# Altium schematic sheet 11_USB_FIFO.SchDoc: USB FIFO
size A4; Organization: Lime Microsystems; Address1: Surrey Tech Centre; Address2: Guildford GU2 7YG; Address3: Surrey; Address4: United Kingdom; Revision: v2.1; SheetNumber: 11; SheetTotal: 15
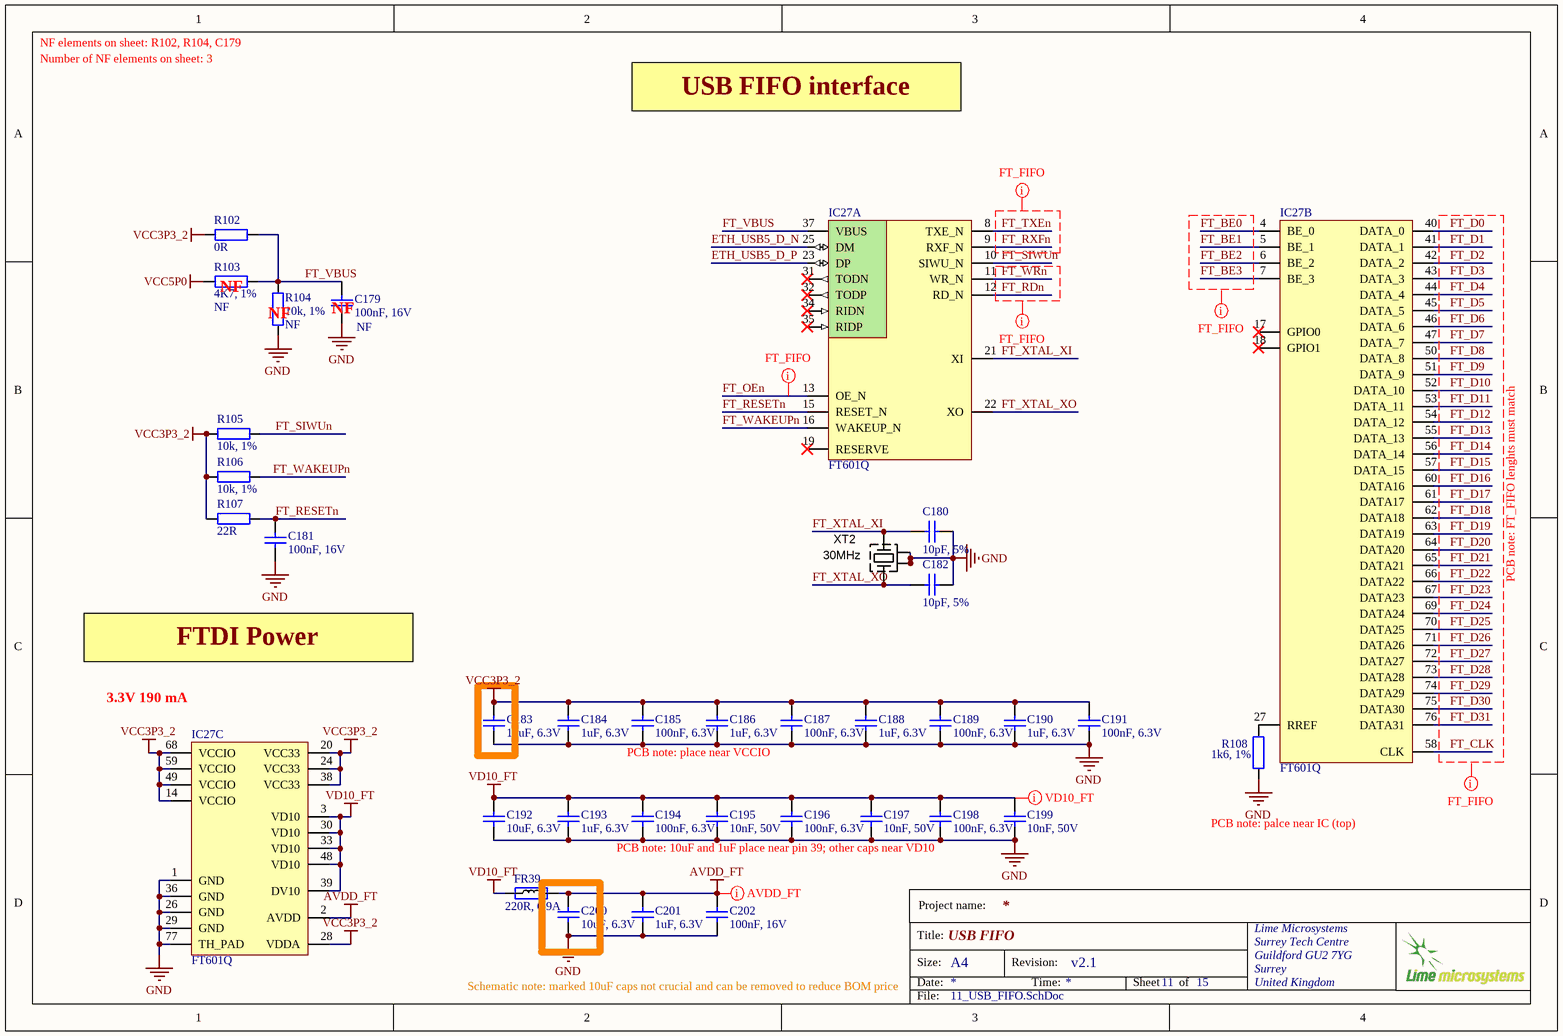
[diagram p0: 11_USB_FIFO.SchDoc]

## Parts
C179  100nF, 16V  Assembly Info: NF  [CAP0402]
C180  10pF, 5%  [CAP0402]
C181  100nF, 16V  [CAP0402]
C182  10pF, 5%  [CAP0402]
C183  10uF, 6.3V  [CAP0603]
C184  1uF, 6.3V  [CAP0201]
C185  100nF, 6.3V  [CAP0201]
C186  1uF, 6.3V  [CAP0201]
C187  100nF, 6.3V  [CAP0201]
C188  1uF, 6.3V  [CAP0201]
C189  100nF, 6.3V  [CAP0201]
C190  1uF, 6.3V  [CAP0201]
C191  100nF, 6.3V  [CAP0201]
C192  10uF, 6.3V  [CAP0603]
C193  1uF, 6.3V  [CAP0201]
C194  100nF, 6.3V  [CAP0201]
C195  10nF, 50V  [CAP0402]
C196  100nF, 6.3V  [CAP0201]
C197  10nF, 50V  [CAP0402]
C198  100nF, 6.3V  [CAP0201]
C199  10nF, 50V  [CAP0402]
C200  10uF, 6.3V  [CAP0603]
C201  1uF, 6.3V  [CAP0201]
C202  100nF, 16V  [CAP0402]
FR39  220R, 0.9A  [RES0402]
IC27  FT601Q  [FT601Q]  (parts A,B,C of 3)
R102  0R  [RES0402]
R103  4K7, 1%  Assembly Info: NF  [RES0402]
R104  10k, 1%  Assembly Info: NF  [RES0402]
R105  10k, 1%  [RES0402]
R106  10k, 1%  [RES0402]
R107  22R  [RES0402]
R108  1k6, 1%  [RES0402]
XT2  30MHz  [CRYSTAL_4-LCC]

## Nets
AVDD_FT: C200.2 C201.2 C202.1 FR39.2 IC27.2(AVDD)
GND: C179.2 C180.2 C181.2 C182.2 C183.1 C184.1 C185.2 C186.1 C187.2 C188.1 C189.2 C190.1 C191.2 C192.1 C193.1 C194.2 C195.2 C196.2 C197.2 C198.2 C199.2 C200.1 C201.1 C202.2 IC27.1(GND) IC27.26(GND) IC27.29(GND) IC27.36(GND) IC27.77(TH_PAD) R104.1 R108.1 XT2.2(GND) XT2.4(GND)
VCC3P3_2: C183.2 C184.2 C185.1 C186.2 C187.1 C188.2 C189.1 C190.2 C191.1 IC27.14(VCCIO) IC27.20(VCC33) IC27.24(VCC33) IC27.28(VDDA) IC27.38(VCC33) IC27.49(VCCIO) IC27.59(VCCIO) IC27.68(VCCIO) R102.1 R105.2 R106.2 R107.2
VCC5P0: R103.2
VD10_FT: C192.2 C193.2 C194.1 C195.1 C196.1 C197.1 C198.1 C199.1 FR39.1 IC27.3(VD10) IC27.30(VD10) IC27.33(VD10) IC27.39(DV10) IC27.48(VD10)
ETH_USB5_D_N: IC27.25(DM)
ETH_USB5_D_P: IC27.23(DP)
FT_BE0: IC27.4(BE_0)
FT_BE1: IC27.5(BE_1)
FT_BE2: IC27.6(BE_2)
FT_BE3: IC27.7(BE_3)
FT_CLK: IC27.58(CLK)
FT_D0: IC27.40(DATA_0)
FT_D1: IC27.41(DATA_1)
FT_D2: IC27.42(DATA_2)
FT_D3: IC27.43(DATA_3)
FT_D4: IC27.44(DATA_4)
FT_D5: IC27.45(DATA_5)
FT_D6: IC27.46(DATA_6)
FT_D7: IC27.47(DATA_7)
FT_D8: IC27.50(DATA_8)
FT_D9: IC27.51(DATA_9)
FT_D10: IC27.52(DATA_10)
FT_D11: IC27.53(DATA_11)
FT_D12: IC27.54(DATA_12)
FT_D13: IC27.55(DATA_13)
FT_D14: IC27.56(DATA_14)
FT_D15: IC27.57(DATA_15)
FT_D16: IC27.60(DATA16)
FT_D17: IC27.61(DATA17)
FT_D18: IC27.62(DATA18)
FT_D19: IC27.63(DATA19)
FT_D20: IC27.64(DATA20)
FT_D21: IC27.65(DATA21)
FT_D22: IC27.66(DATA22)
FT_D23: IC27.67(DATA23)
FT_D24: IC27.69(DATA24)
FT_D25: IC27.70(DATA25)
FT_D26: IC27.71(DATA26)
FT_D27: IC27.72(DATA27)
FT_D28: IC27.73(DATA28)
FT_D29: IC27.74(DATA29)
FT_D30: IC27.75(DATA30)
FT_D31: IC27.76(DATA31)
FT_OEn: IC27.13(OE_N)
FT_RDn: IC27.12(RD_N)
FT_RESETn: C181.1 IC27.15(RESET_N) R107.1
FT_RXFn: IC27.9(RXF_N)
FT_SIWUn: IC27.10(SIWU_N) R105.1
FT_TXEn: IC27.8(TXE_N)
FT_VBUS: C179.1 IC27.37(VBUS) R102.2 R103.1 R104.2
FT_WAKEUPn: IC27.16(WAKEUP_N) R106.1
FT_WRn: IC27.11(WR_N)
FT_XTAL_XI: C180.1 IC27.21(XI) XT2.3(X)
FT_XTAL_XO: C182.1 IC27.22(XO) XT2.1(X)
NetIC27_27: IC27.27(RREF) R108.2

Not connected (* = marked no-connect by the designer): IC27 17(GPIO0)* 18(GPIO1)* 19(RESERVE)* 31(TODN)* 32(TODP)* 34(RIDN)* 35(RIDP)*

## Layout directives
net class FT_FIFO: FT_BE0, FT_BE1, FT_BE2, FT_BE3, FT_CLK, FT_D0, FT_D1, FT_D2, FT_D3, FT_D4, FT_D5, FT_D6, FT_D7, FT_D8, FT_D9, FT_D10, FT_D11, FT_D12, FT_D13, FT_D14, FT_D15, FT_D16, FT_D17, FT_D18, FT_D19, FT_D20, FT_D21, FT_D22, FT_D23, FT_D24, FT_D25, FT_D26, FT_D27, FT_D28, FT_D29, FT_D30, FT_D31, FT_OEn, FT_RDn, FT_RXFn, FT_TXEn, FT_WRn
net class VD10_FT: VD10_FT
net class AVDD_FT: AVDD_FT

## Notes on the sheet
- NF elements on sheet: R102, R104, C179
- Number of NF elements on sheet: 3
- USB FIFO interface
- (near R103) NF
- (near R104) NF
- (near C179) NF
- PCB note: FT_FIFO lenghts must match
- FTDI Power
- (near IC27) 3.3V 190 mA
- PCB note: place near VCCIO
- PCB note: 10uF and 1uF place near pin 39; other caps near VD10
- PCB note: palce near IC (top)
- Schematic note: marked 10uF caps not crucial and can be removed to reduce BOM price
- Project name:
- Title:
- Size:
- Date:
- A4
- Revision:
- Time:
- Sheet
- of
- File:

## Library data of the parts
C179 C181 = Cap_0603: Manufacturer Part Number 1: GRM155R71C104KA88D; Part Description: CAP CER 0.1UF 16V X7R 0402; Brand: Murata Electronics; Tolerance: 10 %; Type: General Purpose MLCC; Capacitance: 0.1 uF; Temperature Coefficient / Code: +/- 15 %; Case Height: 0.5 mm; Case Length: 1 mm; Dielectric: X7R; Supplier 1: Mouser; Supplier Part Number 1: 81-GRM155R71C104KA88; Case Code - in: 0402; Manufacturer: Murata Electronics; Category: Multilayer Ceramic Capacitors MLCC - SMD/SMT; Voltage Rating DC: 16 V; Value: 100nF, 16V; Manufacturer Part Number: GRM155R71C104KA88D; Case Code - mm: 1005; Case Width: 0.5 mm; Maximum Operating Temperature: + 125 C; Minimum Operating Temperature: - 55 C; Minimum Order Quantity: 1; Operating Temperature Range: - 55 C to + 125 C; Package / Case: 0402 (1005 metric); Packaging: Reel; Product: General Type MLCCs; Product Category: Low & Medium Capacitance SMD Ceramic Chip Capacitors; Reeling: True; RoHS - Mouser: Y; RoHS: RoHS Compliant; Series: GRM; Standard Pack Qty: 10000; Termination Style: SMD/SMT
C180 C182 = Cap_0402: Manufacturer: AVX; Manufacturer Part Number 1: 04023A100JAT2A; Part Description: 10pF ±5% 25V C0G, NP0 Ceramic Capacitor -55°C ~ 125°C Surface Mount, MLCC 0402 (1005 Metric) 0.039" L x 0.020" W (1.00mm x 0.50mm); Capacitance: 10; Ceramic Capacitor Case: 0402 [1005 Metric]; Capacitor Case Style: 0402 [1005 Metric]<!--FANDB--><div class="features-and-benefits-container"></div>; Voltage Rating: 25; Supplier 1: Farnell; Supplier Part Number 1: 2332478RL; Capacitance Tolerance: ± 5%; value: 10pF, 5%; Capacitance Tolerance ±: ± 5%; MSL: MSL 1 - Unlimited; Operating Temperature Max: 125; Operating Temperature Min: -55; Packaging: Cut Tape
C183 C192 C200 = Cap_0603: Manufacturer Part Number 1: CC0603MRX5R5BB106; Manufacturer: Yageo; Part Description: 10µF ±20% 6.3V X5R Ceramic Capacitor -55°C ~ 85°C Surface Mount, MLCC 0603 (1608 Metric) 0.063" L x 0.031" W (1.60mm x 0.80mm); Capacitance: 10µF; Tolerance: ±20%; Supplier 1: Digi-Key; Supplier Part Number 1: 311-1448-2-ND; Package / Case: 0603 (1608 Metric); Category: Capacitors; Voltage - Rated: 6.3V; Value: 10uF, 6.3V
C184 C186 C188 C190 C193 C201 = Cap_0402: Manufacturer: TDK Corporation; Manufacturer Part Number 1: JMK063ABJ105MP-F; Part Description: 1µF ±20% 6.3V X5R Ceramic Capacitor -55°C ~ 85°C Surface Mount, MLCC 0201 (0603 Metric) 0.024" L x 0.012" W (0.60mm x 0.30mm); Tolerance: ±20%; Capacitance: 1.0µF; Temperature Coefficient: X5R; Value: 1uF, 6.3V; Supplier 1: Digi-Key; Supplier Part Number 1: 587-5864-2-ND; Applications: General Purpose; Features: -; Lead Style: -; Ratings: -; Thickness (Max): -; Lead Spacing: -; Height - Seated (Max): -; Size / Dimension: 0.024" L x 0.012" W (0.60mm x 0.30mm); Mounting Type: Surface Mount, MLCC; Operating Temperature: -55°C ~ 85°C; Package / Case: 0201 (0603 Metric); Packaging: Cut Tape (CT); Voltage - Rated: 6.3V; Category: Capacitors; RoHS: RoHS Compliant
C185 C187 C189 C191 C194 C196 C198 = Cap_0402: Manufacturer: Murata; Manufacturer Part Number 1: GRT033C81A104KE01D; Part Description: 0.10µF ±10% 6.3V X6S Ceramic Capacitor -55°C ~ 105°C Surface Mount, MLCC 0201 (0603 Metric) 0.024" L x 0.012" W (0.60mm x 0.30mm); Capacitance: 0.1 uF; Dielectric: X6S; Brand: Murata Electronics; Type: Voltage and Temperature Derating Recommended Product; Voltage Rating DC: 6.3 VDC; Product Status: New Product; Tolerance: 10 %; Value: 100nF, 6.3V; Package / Case: 0201 (0603 metric); Width: 0.3 mm; Minimum Order Quantity: 1; Category: Multilayer Ceramic Capacitors MLCC - SMD/SMT; Termination Style: SMD/SMT; Case Code - mm: 0603; Maximum Operating Temperature: + 125 C; Length: 0.6 mm; Product: General Type MLCCs; Case Code - in: 0201; RoHS: RoHS Compliant; Minimum Operating Temperature: - 55 C; RoHS - Mouser: Y; Height: 0.3 mm; Packaging: Reel; Series: GRM; Reeling: True; Supplier 1: Digi-Key; Supplier Part Number 1: 490-12232-1-ND
C195 C197 C199 = Cap_0402: Part Description: 10000pF ±10% 50V Ceramic Capacitor X7R 0402 (1005 Metric); Manufacturer: Murata Electronics North America; Manufacturer Part Number 1: GRM155R71H103KA88D; Tolerance: ±10%; Temperature Coefficient: X7R; Value: 10nF, 50V; Supplier 1: Digi-Key; Supplier Part Number 1: 490-4516-2-ND; RoHS: RoHS Compliant; Category: Capacitors; Stock 1: 10970000; Pricing 1: 10000=0.00185, 20000=0.00176, 30000=0.00167 (USD); Packaging: Tape & Reel (TR); Part Status: Active; Voltage - Rated: 50V; Operating Temperature: -55°C ~ 125°C; Features: -; Ratings: -; Applications: General Purpose; Mounting Type: Surface Mount, MLCC; Package / Case: 0402 (1005 Metric); Size / Dimension: 0.039" L x 0.020" W (1.00mm x 0.50mm); Height - Seated (Max): -; Thickness (Max): 0.022" (0.55mm); Lead Spacing: -; Lead Style: -; ComponentLink1URL: http://www.murata.com/~/media/webrenewal/support/library/catalog/products/capacitor/mlcc/c02e.ashx?la=en-us; ComponentLink1Description: http://www.murata.com/~/media/webrenewal/support/library/catalog/products/capacitor/mlcc/c02e.ashx?la=en-us
C202 = Cap_0402: Manufacturer: Murata Electronics; Manufacturer Part Number: GRM155R71C104KA88D; Part Description: CAP CER 0.1UF 16V X7R 0402; Tolerance: 10 %; Type: General Purpose MLCC; Capacitance: 0.1 uF; Case Length: 1 mm; Dielectric: X7R; Case Height: 0.5 mm; Temperature Coefficient / Code: +/- 15 %; Value: 100nF, 16V; Supplier 1: Mouser; Supplier Part Number 1: 81-GRM155R71C104KA88; Case Code - in: 0402; RoHS: RoHS Compliant; Operating Temperature Range: - 55 C to + 125 C; Series: GRM; Termination Style: SMD/SMT; Package / Case: 0402 (1005 metric); Voltage Rating DC: 16 V; Maximum Operating Temperature: + 125 C; Case Code - mm: 1005; Minimum Operating Temperature: - 55 C; Product Category: Low & Medium Capacitance SMD Ceramic Chip Capacitors; Packaging: Reel; Product: General Type MLCCs; Category: Multilayer Ceramic Capacitors MLCC - SMD/SMT; Brand: Murata Electronics; Case Width: 0.5 mm; RoHS - Mouser: Y; Standard Pack Qty: 10000; Minimum Order Quantity: 1; Reeling: True; Manufacturer Part Number 1: GRM155R71C104KA88D
FR39 = Ferrite: Manufacturer: TDK Corporation; Manufacturer Part Number 1: MPZ1005S221ET000; Part Description: FERRITE BEAD 220 OHM 0402 1LN; Impedance @ Frequency: 220 Ohm @ 100MHz; Current Rating: 900mA; DC Resistance (DCR): 220 mOhm Max; Supplier 1: Digi-Key; Package / Case: 0402 (1005 Metric); Category: Filters; Supplier Part Number 1: 445-9329-2-ND; Value: 220R, 0.9A
IC27 = FT601Q: Manufacturer: FTDI, Future Technology Devices International Ltd; Manufacturer Part Number 1: FT601Q-B-T; Part Description: IC USB3-32BIT SYNC FIFO 76QFN; Function: Bridge, USB to FIFO; Standards: USB 3.0; Voltage - Supply: 1.65 V ~ 3.6 V; Protocol: USB; Interface: FIFO; Supplier 1: Digi-Key; Operating Temperature: -40°C ~ 85°C; Packaging: Tray; Category: Integrated Circuits (ICs); Package / Case: 76-VFQFN Exposed Pad; Supplier Device Package: 76-QFN (9x9); Current - Supply: -; RoHS: RoHS Compliant; Supplier Part Number 1: 768-1311-ND
R102 = Res_0402: Manufacturer: Yageo; Part Description: RES SMD 0.0OHM JUMPER 1/16W 0402; Manufacturer Part Number 1: RC0402JR-070RL; Power (Watts): 0.063W, 1/16W; Resistance (Ohms): 0.0; Tolerance: Jumper; Supplier 1: Digi-Key; Supplier Part Number 1: 311-0.0JRTR-ND; Composition: Thick Film; Package / Case: 0402 (1005 Metric); Category: Resistors; Value: 0R; Features: Moisture Resistant; Height: 0.016" (0.40mm); Number of Terminations: 2; Operating Temperature: -55°C ~ 155°C; Packaging: Tape & Reel (TR); RoHS: RoHS Compliant; Size / Dimension: 0.039" L x 0.020" W (1.00mm x 0.50mm); Supplier Device Package: 0402; Temperature Coefficient: -
R103 = Res_0402: Manufacturer: Yageo; Manufacturer Part Number 1: RC0402FR-074K7L; Part Description: ±1% 0.063W, 1/16W Chip Resistor 0402 (1005 Metric) Moisture Resistant Thick Film; Power (Watts): 0.063W, 1/16W; Temperature Coefficient: ±100ppm/°C; Supplier 1: Digi-Key; Supplier Part Number 1: 311-4.7KLRCT-ND; RoHS: RoHS Compliant; Category: Resistors; Stock 1: 4788231; Pricing 1: 1=0.1, 10=0.014, 100=0.0056, 1000=0.00253, 2500=0.0022, 5000=0.00181 (USD); Packaging: Cut Tape (CT); Part Status: Active; Tolerance: ±1%; Composition: Thick Film; Features: Moisture Resistant; Operating Temperature: -55°C ~ 155°C; Package / Case: 0402 (1005 Metric); Supplier Device Package: 0402; Size / Dimension: 0.039" L x 0.020" W (1.00mm x 0.50mm); Height - Seated (Max): 0.016" (0.40mm); Failure Rate: -; ComponentLink1URL: http://www.yageo.com/documents/recent/PYu-RC_Group_51_RoHS_L_7.pdf; ComponentLink1Description: http://www.yageo.com/documents/recent/PYu-RC_Group_51_RoHS_L_7.pdf; Value: 4K7, 1%
R104-R106 = Res_0402: Manufacturer: Yageo; Manufacturer Part Number 1: RC0402FR-0710KL; Part Description: RES SMD 10K OHM 1% 1/16W 0402; Temperature Coefficient: ±100ppm/°C; Power (Watts): 0.063W, 1/16W; Value: 10k, 1%; Supplier 1: Digi-Key; Supplier Part Number 1: 311-10.0KLRTR-ND; Resistance (Ohms): 10k; Packaging: Tape & Reel (TR); RoHS: RoHS Compliant; Package / Case: 0402 (1005 Metric); Tolerance: ±1%; Operating Temperature: -55°C ~ 155°C; Size / Dimension: 0.039" L x 0.020" W (1.00mm x 0.50mm); Number of Terminations: 2; Category: Resistors; Height: 0.016" (0.40mm); Supplier Device Package: 0402; Features: Moisture Resistant; Composition: Thick Film
R107 = Res_0402: Manufacturer: Yageo; Manufacturer Part Number 1: RC0402FR-0722RL; Part Description: RES SMD 22 OHM 1% 1/16W 0402; Temperature Coefficient: ±100ppm/°C; Resistance (Ohms): 22; Tolerance: ±1%; Value: 22R; Supplier 1: Digi-Key; Supplier Part Number 1: 311-22.0LRTR-ND; Category: Resistors; Supplier Device Package: 0402; Composition: Thick Film
R108 = Res_0402: Manufacturer Part Number 1: RC0402FR-071K6L; Manufacturer: Yageo; Part Description: RES SMD 1.6K OHM 1% 1/16W 0402; Resistance (Ohms): 1.6k; Temperature Coefficient: ±100ppm/°C; Power (Watts): 0.063W, 1/16W; Value: 1k6, 1%; Number of Terminations: 2; Height: 0.016" (0.40mm); Supplier Device Package: 0402; Size / Dimension: 0.039" L x 0.020" W (1.00mm x 0.50mm); Supplier Part Number 1: YAG3045CT-ND; Features: Moisture Resistant; Operating Temperature: -55°C ~ 155°C; Supplier 1: Digi-Key; Category: Resistors; RoHS: RoHS Compliant; Packaging: Cut Tape (CT); Composition: Thick Film; Tolerance: ±1%; Package / Case: 0402 (1005 Metric)
XT2 = CRYSTAL_19M2: Oscillator Crystal 25 MHz; Manufacturer: AVX Corp/Kyocera Corp; Manufacturer Part Number 1: CX3225SB30000D0FPLCC; Part Description: 30MHz ±10ppm Crystal 8pF 50 Ohm -40°C ~ 85°C Surface Mount 4-SMD, No Lead (DFN, LCC); Operating Mode: Fundamental; Frequency Tolerance: ±10ppm; Frequency Stability: ±20ppm; Load Capacitance: 8pF; ESR (Equivalent Series Resistance): 50 Ohm; Height: 0.024" (0.60mm); Size / Dimension: 0.126" L x 0.098" W (3.20mm x 2.50mm); Mounting Type: Surface Mount; Package / Case: 4-SMD, No Lead (DFN, LCC); Category: Crystals and Oscillators; Ratings: -; Supplier 1: Digi-Key; Operating Temperature: -40°C ~ 85°C; Packaging: Cut Tape (CT); RoHS: RoHS Compliant; Type: MHz Crystal; Supplier Part Number 1: 1253-1368-1-ND; Frequency: 30MHz; Value: 30MHz